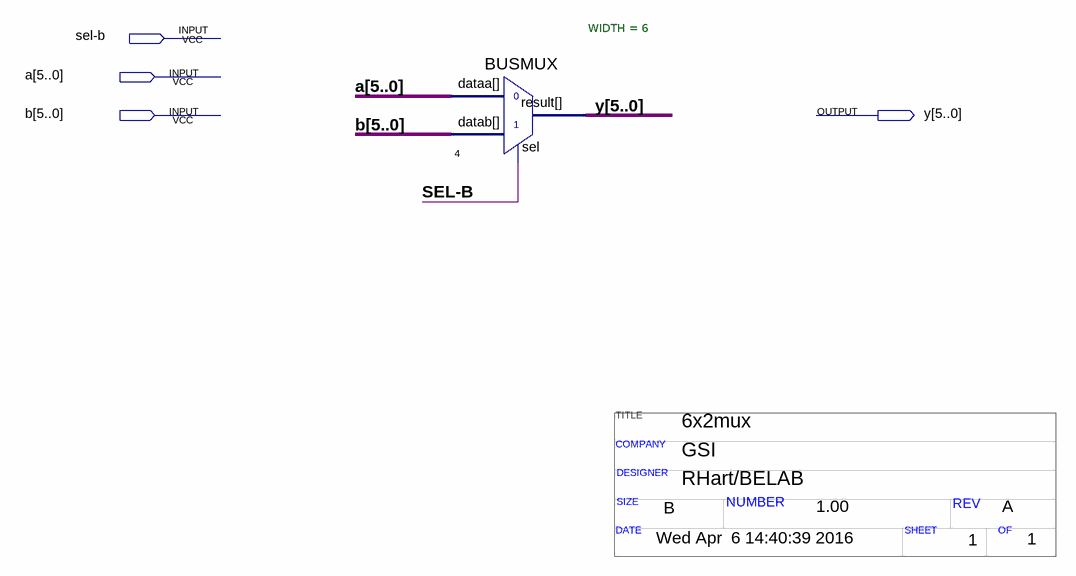
[diagram p0: schematic sheet]
// Quartus schematic 6x2mux.bdf as structural Verilog: 1 symbols, 4 pins
// Title block: TITLE: 6x2mux; COMPANY: GSI; DESIGNER: RHart/BELAB; SIZE: B; NUMBER: 1.00; REV: A; DATE: Wed Apr  6 14:40:39 2016; SHEET: 1; OF: 1
module \6x2mux  (
  input  \sel-b ,
  input  [5:0] a,
  input  [5:0] b,
  output [5:0] y
);

  BUSMUX #(.WIDTH(6)) u_4 (.datab(b), .sel(\sel-b ), .dataa(a), .result(y));
endmodule
